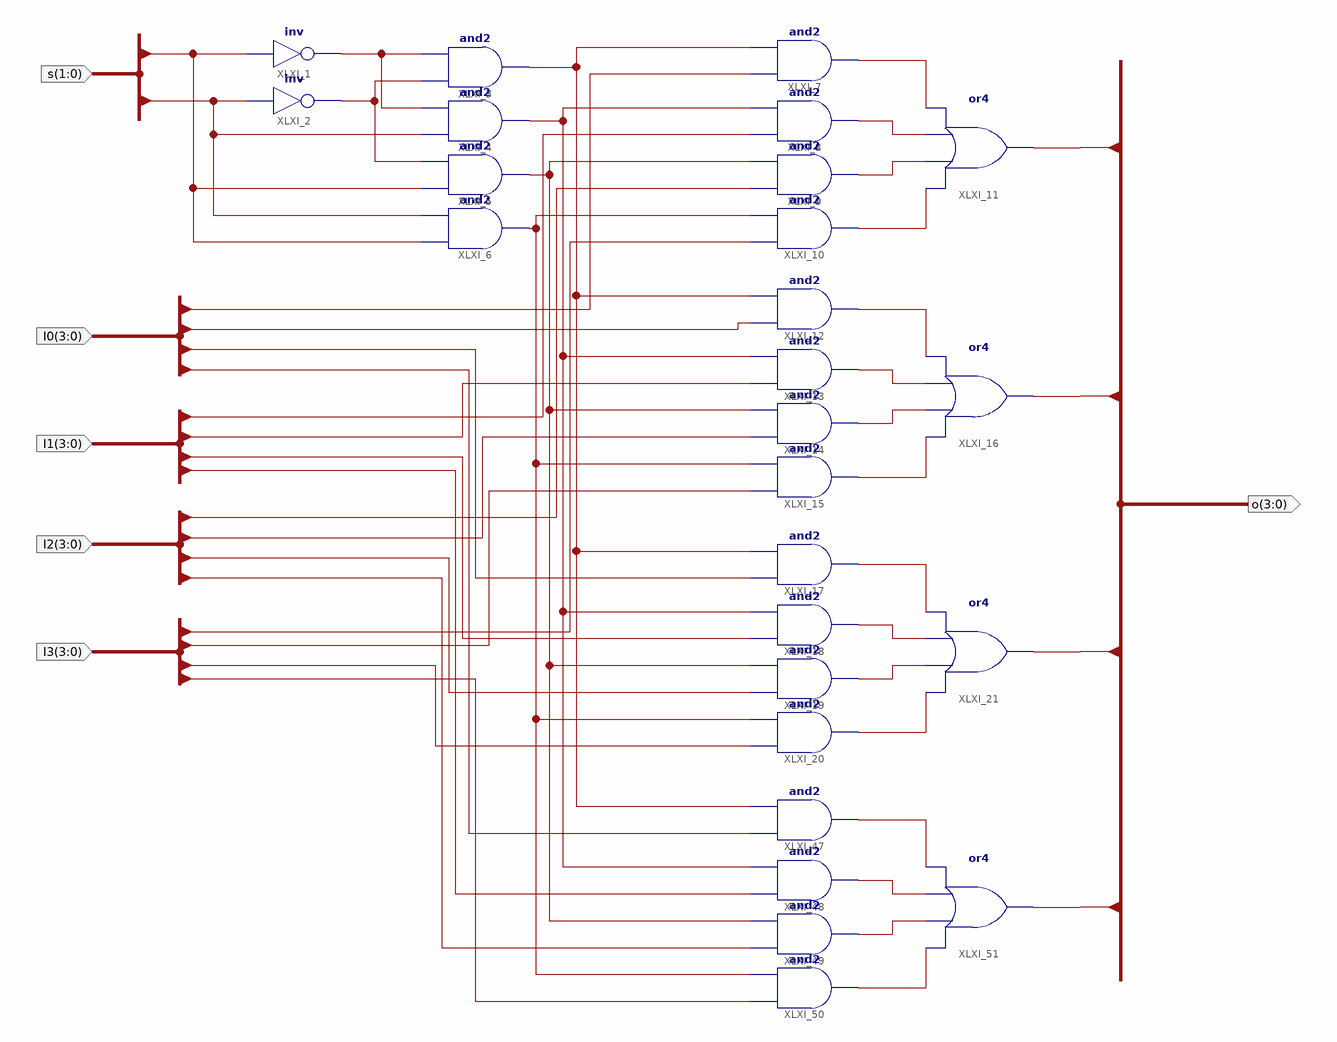
[diagram p0: schematic sheet 1]
// Xilinx ISE schematic Mux4to14b.sch (kintex7) as structural Verilog: 26 symbols, 6 ports
module Mux4to14b (
  input  [1:0] s,
  input  [3:0] I0,
  input  [3:0] I1,
  input  [3:0] I2,
  input  [3:0] I3,
  output [3:0] o
);

  wire XLXN_4, XLXN_6, XLXN_9, XLXN_10, XLXN_11, XLXN_12, XLXN_13, XLXN_14, XLXN_15, XLXN_16, XLXN_17,
       XLXN_18, XLXN_19, XLXN_20, XLXN_41, XLXN_42, XLXN_43, XLXN_44, XLXN_45, XLXN_46, XLXN_47, XLXN_48;

  not XLXI_1 (XLXN_4, s[1]);
  not XLXI_2 (XLXN_6, s[0]);
  and XLXI_3 (XLXN_45, XLXN_6, XLXN_4);
  and XLXI_4 (XLXN_46, s[0], XLXN_4);
  and XLXI_5 (XLXN_47, s[1], XLXN_6);
  and XLXI_6 (XLXN_48, s[1], s[0]);
  and XLXI_7 (XLXN_9, I0[0], XLXN_45);
  and XLXI_8 (XLXN_10, I1[0], XLXN_46);
  and XLXI_9 (XLXN_11, I2[0], XLXN_47);
  and XLXI_10 (XLXN_12, I3[0], XLXN_48);
  or XLXI_11 (o[0], XLXN_12, XLXN_11, XLXN_10, XLXN_9);
  and XLXI_17 (XLXN_17, I0[2], XLXN_45);
  and XLXI_18 (XLXN_18, I1[2], XLXN_46);
  and XLXI_19 (XLXN_19, I2[2], XLXN_47);
  and XLXI_20 (XLXN_20, I3[2], XLXN_48);
  or XLXI_21 (o[2], XLXN_20, XLXN_19, XLXN_18, XLXN_17);
  and XLXI_12 (XLXN_13, I0[1], XLXN_45);
  and XLXI_13 (XLXN_14, I1[1], XLXN_46);
  and XLXI_14 (XLXN_15, I2[1], XLXN_47);
  and XLXI_15 (XLXN_16, I3[1], XLXN_48);
  or XLXI_16 (o[1], XLXN_16, XLXN_15, XLXN_14, XLXN_13);
  and XLXI_47 (XLXN_41, I0[3], XLXN_45);
  and XLXI_48 (XLXN_42, I1[3], XLXN_46);
  and XLXI_49 (XLXN_43, I2[3], XLXN_47);
  and XLXI_50 (XLXN_44, I3[3], XLXN_48);
  or XLXI_51 (o[3], XLXN_44, XLXN_43, XLXN_42, XLXN_41);
endmodule
